# EasyEDA Pro project ProPrj_CyMouse.epro, schematic 侧键
Board Name: 侧键; Create Date: 2025-05-09; Page Name: P1; Project Name: my_mouse; Schematic Name: 侧键; Update Date: 2025-05-14; Company: 嘉立创EDA; Page Size: A4; Version: V1.0
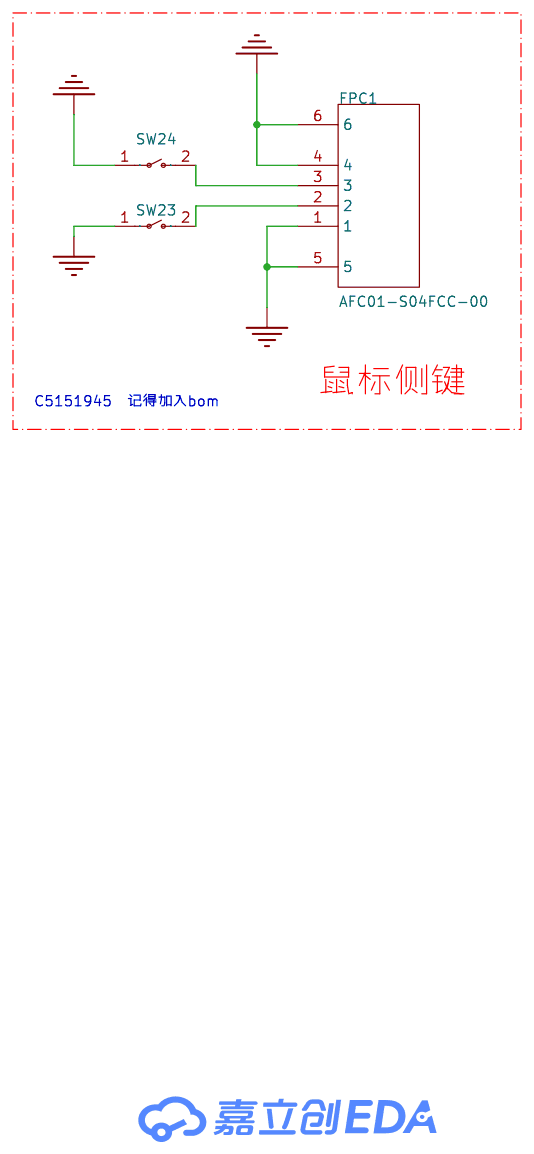
[diagram p1: schematic sheet]

## Parts
FPC1  AFC01-S04FCC-00  [FFC-SMD_4P-P0.50_AFC01-S04FCC-00]
SW23  TS-1007S-AR02516  [SW-SMD_L6.1-W3.6-LS7.9]
SW24  TS-1007S-AR02516  [SW-SMD_L6.1-W3.6-LS7.9]

## Library data of the parts
FPC1 = AFC01-S04FCC-00: 锁定特性:翻盖式;触点类型:下接;触点数量:4P;间距:0.5mm;安装类型:卧贴;; LCSC Part Name: 间距:0.5mm P数:4P 翻盖式 下接; Supplier Part: C262260; Manufacturer: JS(钜硕电子); Supplier Footprint: SMD,P=0.5mm,卧贴; JLCPCB Part Class: 扩展库; Datasheet: https://atta.szlcsc.com/upload/public/pdf/source/20190816/C413942_2A72D1AC756EAE17EEDF756A339D4500.pdf; Supplier: LCSC; Locking Feature: 翻盖式; Contact Type: 下接; Number of Contacts: 4P; Pitch: 0.5mm; Mounting Type: 卧贴; FFC, FCB Thickness: 0.3mm; Height Above Board: 2mm
SW23 SW24 = TS-1007S-AR02516: 电路结构:单刀单掷;按钮形状:矩形按钮;作用力:160gf;安装方式:立贴;开关长度:6.1mm;开关宽度:3.7mm;开关高度:2.5mm;带支架:不带;触点电流:50mA;额定电压(DC):12V;绝缘电阻:100MΩ;机械寿命:5万次;; LCSC Part Name: 6.1*3.7*2.5mm 立贴 轻触开关; Supplier Part: C720381; Manufacturer: XUNPU(讯普); Supplier Footprint: SMD; JLCPCB Part Class: 扩展库; Datasheet: https://atta.szlcsc.com/upload/public/pdf/source/20200812/C720381_7D5C1A68D18F0196EF37FF8AC1146778.pdf; Supplier: LCSC; Circuit: 单刀单掷; Actuator Style: 矩形按钮; Operating Force: 160gf; Mounting Style: 立贴; Switch Length: 6.1mm; Switch Width: 3.7mm; Switch Height: 2.5mm; Strike Gundam: 不带; Contact Current: 50mA; Voltage Rating (DC): 12V; Insulation Resistance: 100MΩ; Actuator/Cap Color: 灰色; Pin Style: 鸥翼型; Mechanical Life: 5万次; Operating Temperature: -30℃~+80℃

## Nets
GND: FPC1.1 FPC1.4 FPC1.5 FPC1.6 SW23.1 SW24.1
$1N784: FPC1.3 SW24.2
$1N789: FPC1.2 SW23.2

## Notes on the sheet
- 鼠标侧键
- C5151945  记得加入bom
